# EAGLE design CITestShield (EAGLE 7.3.0)
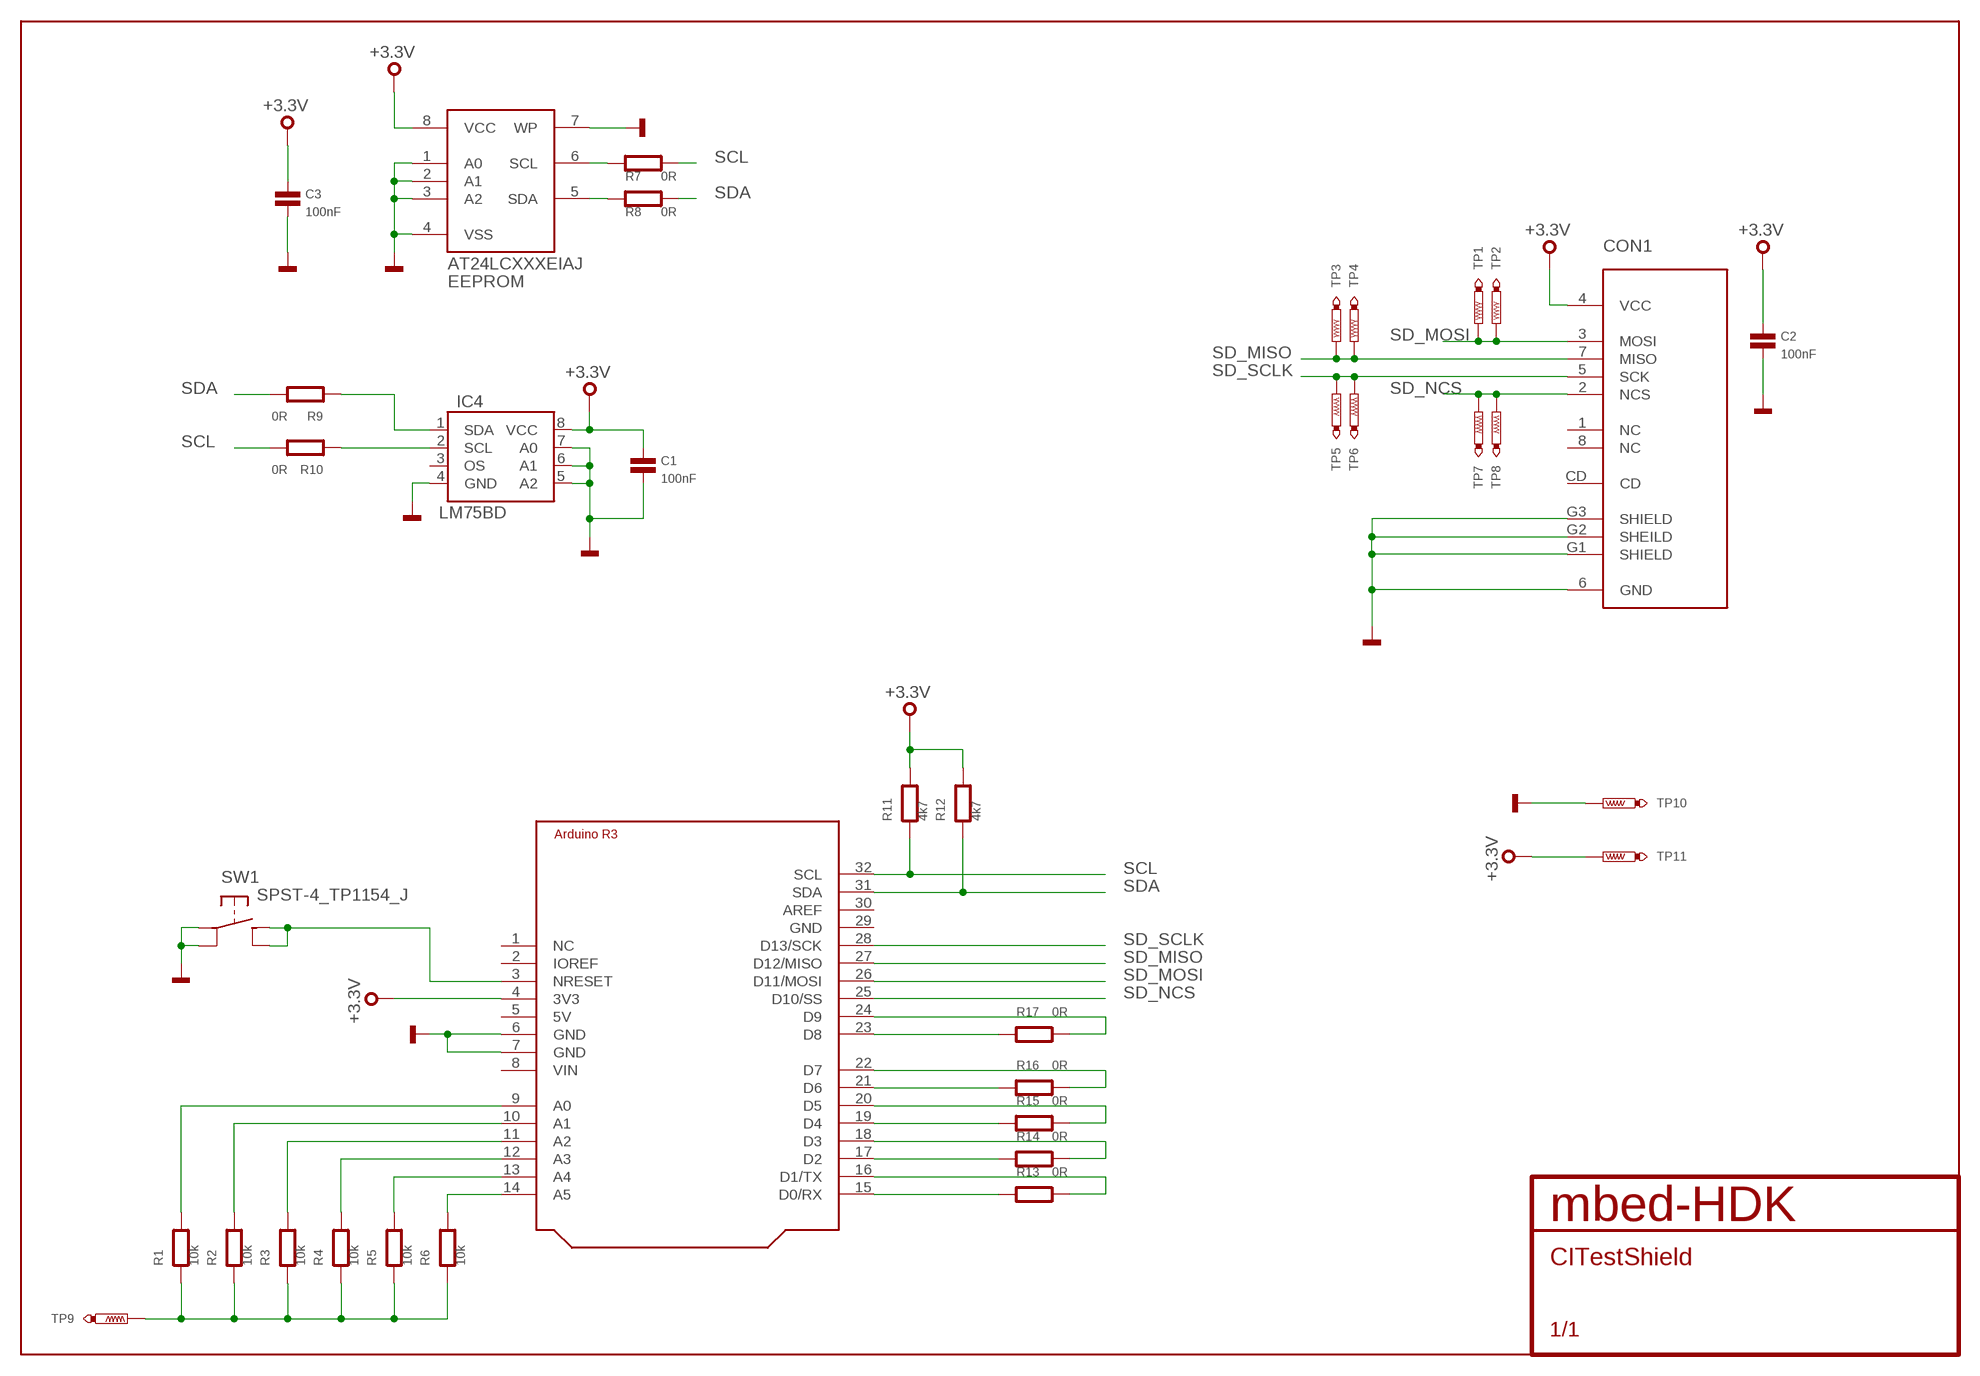
[diagram p0: schematic, sheet 1]

## Parts
BRD1  ARDUINO-R3_SILK  [ARDUINO-R3-SILK]
C1  100nF  C0603  [0603]
C2  100nF  C0603  [0603]
C3  100nF  C0603  [0603]
CON1  MICRO-SD  [AMPHENOL-101-00660-68-6]
EEPROM  AT24LCXXXEIAJ  [SO08-EIAJ]
IC4  LM75BD  [SO8]
R1  10k  R0603  [0603]
R2  10k  R0603  [0603]
R3  10k  R0603  [0603]
R4  10k  R0603  [0603]
R5  10k  R0603  [0603]
R6  10k  R0603  [0603]
R7  0R  R0603  [0603]
R8  0R  R0603  [0603]
R9  0R  R0603  [0603]
R10  0R  R0603  [0603]
R11  4k7  R0603  [0603]
R12  4k7  R0603  [0603]
R13  0R  R0603  [0603]
R14  0R  R0603  [0603]
R15  0R  R0603  [0603]
R16  0R  R0603  [0603]
R17  0R  R0603  [0603]
SW1  SPST-4_TP1154_J  [TP-1154X]
TP1  TEST-POINT-50R-SMD  [TP50-SMD]
TP2  TEST-POINT-50R-SMD  [TP50-SMD]
TP3  TEST-POINT-50R-SMD  [TP50-SMD]
TP4  TEST-POINT-50R-SMD  [TP50-SMD]
TP5  TEST-POINT-50R-SMD  [TP50-SMD]
TP6  TEST-POINT-50R-SMD  [TP50-SMD]
TP7  TEST-POINT-50R-SMD  [TP50-SMD]
TP8  TEST-POINT-50R-SMD  [TP50-SMD]
TP9  TEST-POINT-50R-SMD  [TP50-SMD]
TP10  TEST-POINT-50R-SMD  [TP50-SMD]
TP11  TEST-POINT-50R-SMD  [TP50-SMD]

## Nets
+3.3V: BRD1.4(3V3) C1.1 C2.1 C3.1 CON1.4(VCC) EEPROM.8(VCC) IC4.8(VCC) R11.2 R12.2 TP11.TP
GND: BRD1.6(GND) BRD1.7(GND) C1.2 C2.2 C3.2 CON1.6(GND) CON1.G1(SHIELD) CON1.G2(SHEILD) CON1.G3(SHIELD) EEPROM.1(A0) EEPROM.2(A1) EEPROM.3(A2) EEPROM.4(VSS) EEPROM.7(WP) IC4.4(GND) IC4.5(A2) IC4.6(A1) IC4.7(A0) SW1.A1 SW1.A2 TP10.TP
N$1: R1.1 R2.1 R3.1 R4.1 R5.1 R6.1 TP9.TP
N$2: BRD1.9(A0) R1.2
N$3: BRD1.10(A1) R2.2
N$4: BRD1.11(A2) R3.2
N$5: BRD1.12(A3) R4.2
N$6: BRD1.13(A4) R5.2
N$7: BRD1.14(A5) R6.2
N$8: BRD1.21(D6) R16.1
N$9: BRD1.22(D7) R16.2
N$10: BRD1.24(D9) R17.2
N$11: BRD1.23(D8) R17.1
N$12: BRD1.16(D1/TX) R13.2
N$13: BRD1.15(D0/RX) R13.1
N$14: BRD1.17(D2) R14.1
N$15: BRD1.18(D3) R14.2
N$16: BRD1.20(D5) R15.2
N$17: BRD1.19(D4) R15.1
N$18: BRD1.3(NRESET) SW1.B1 SW1.B2
N$19: IC4.2(SCL) R10.1
N$20: IC4.1(SDA) R9.1
N$22: EEPROM.6(SCL) R7.1
N$23: EEPROM.5(SDA) R8.1
SCL: BRD1.32(SCL) R7.2 R10.2 R11.1
SD_MISO: BRD1.27(D12/MISO) CON1.7(MISO) TP3.TP TP4.TP
SD_MOSI: BRD1.26(D11/MOSI) CON1.3(MOSI) TP1.TP TP2.TP
SD_NCS: BRD1.25(D10/SS) CON1.2(NCS) TP7.TP TP8.TP
SD_SCLK: BRD1.28(D13/SCK) CON1.5(SCK) TP5.TP TP6.TP
SDA: BRD1.31(SDA) R8.2 R9.2 R12.1
Unconnected: BRD1.1(NC) BRD1.2(IOREF) BRD1.5(5V) BRD1.8(VIN) BRD1.29(GND) BRD1.30(AREF) CON1.1(NC) CON1.8(NC) CON1.CD IC4.3(OS)

## Library data of the parts
BRD1 = mbed-HDK:ARDUINO-R3
C1-C3 = mbed-HDK:C: Capacitor
CON1 = mbed-HDK:MICRO-SD
EEPROM = mbed-HDK:AT24LCXXX: I2C EEPROM, 24LC family
IC4 = mbed-HDK:LM75BD
R1-R17 = mbed-HDK:R
SW1 = mbed-HDK:SPST-4
TP1-TP11 = mbed-HDK:TEST-POINT

## Board
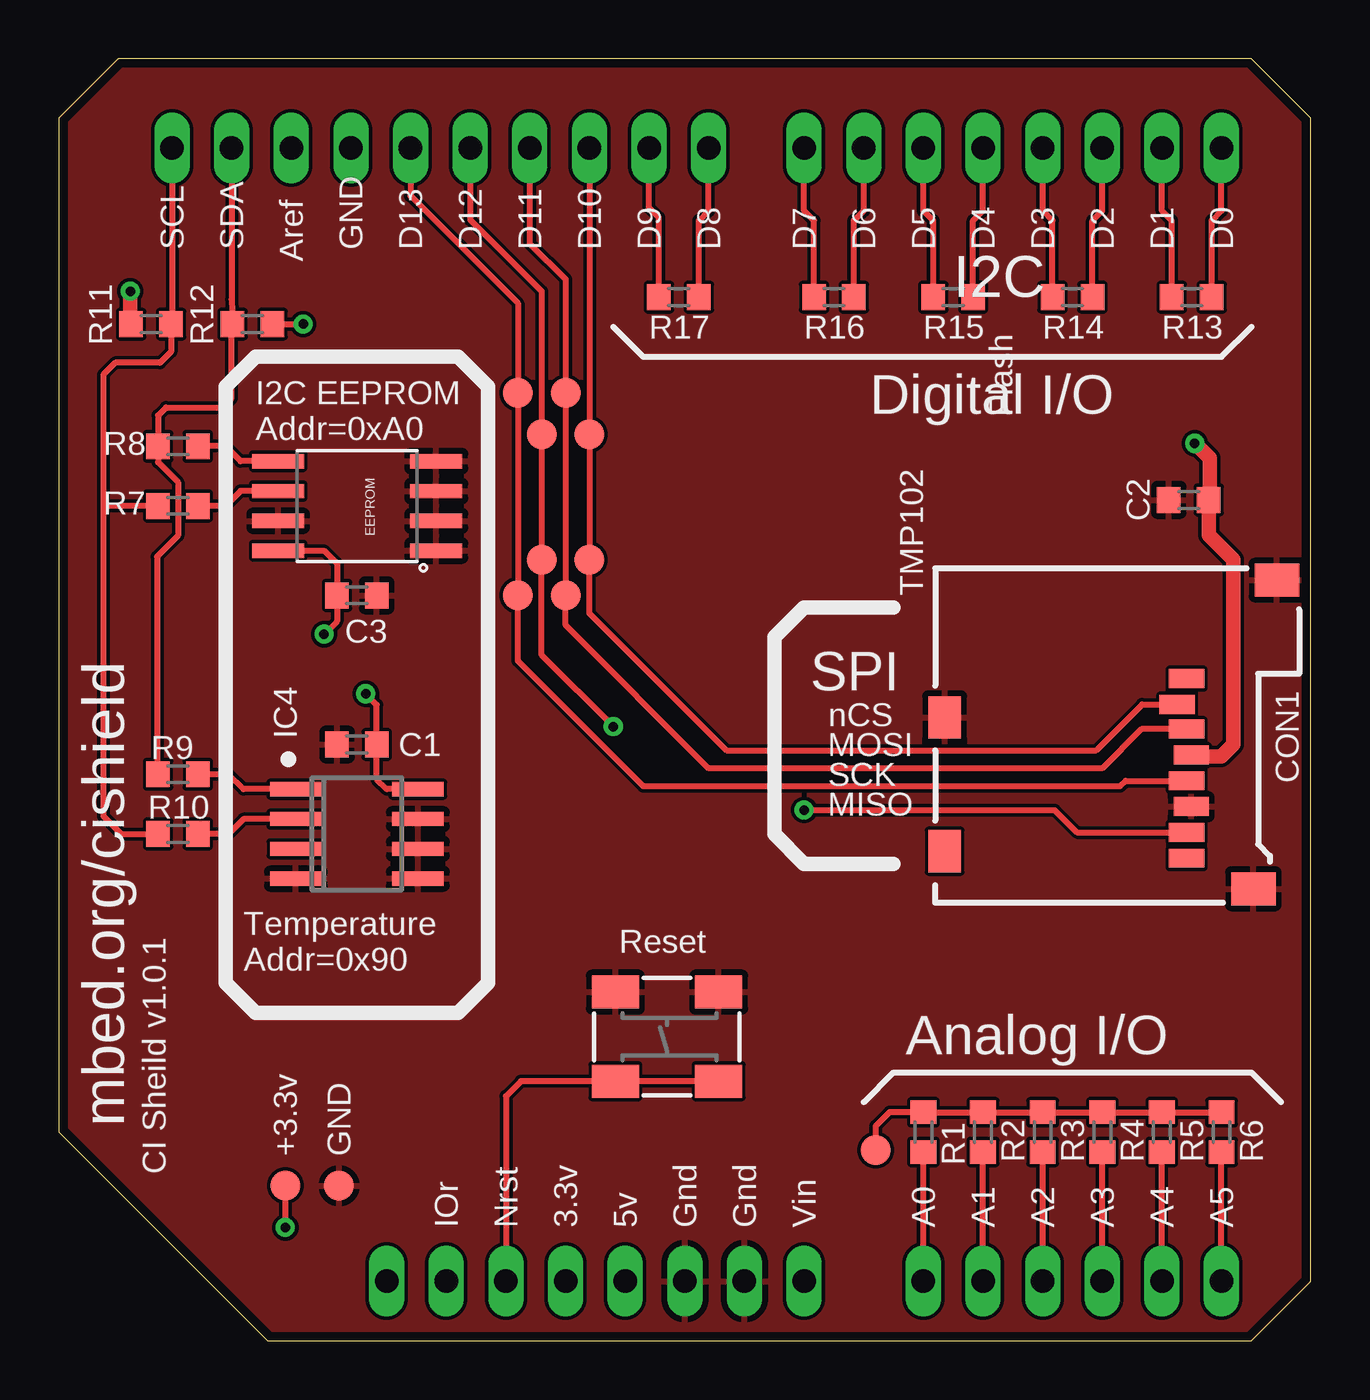
[diagram p1: board, top side]
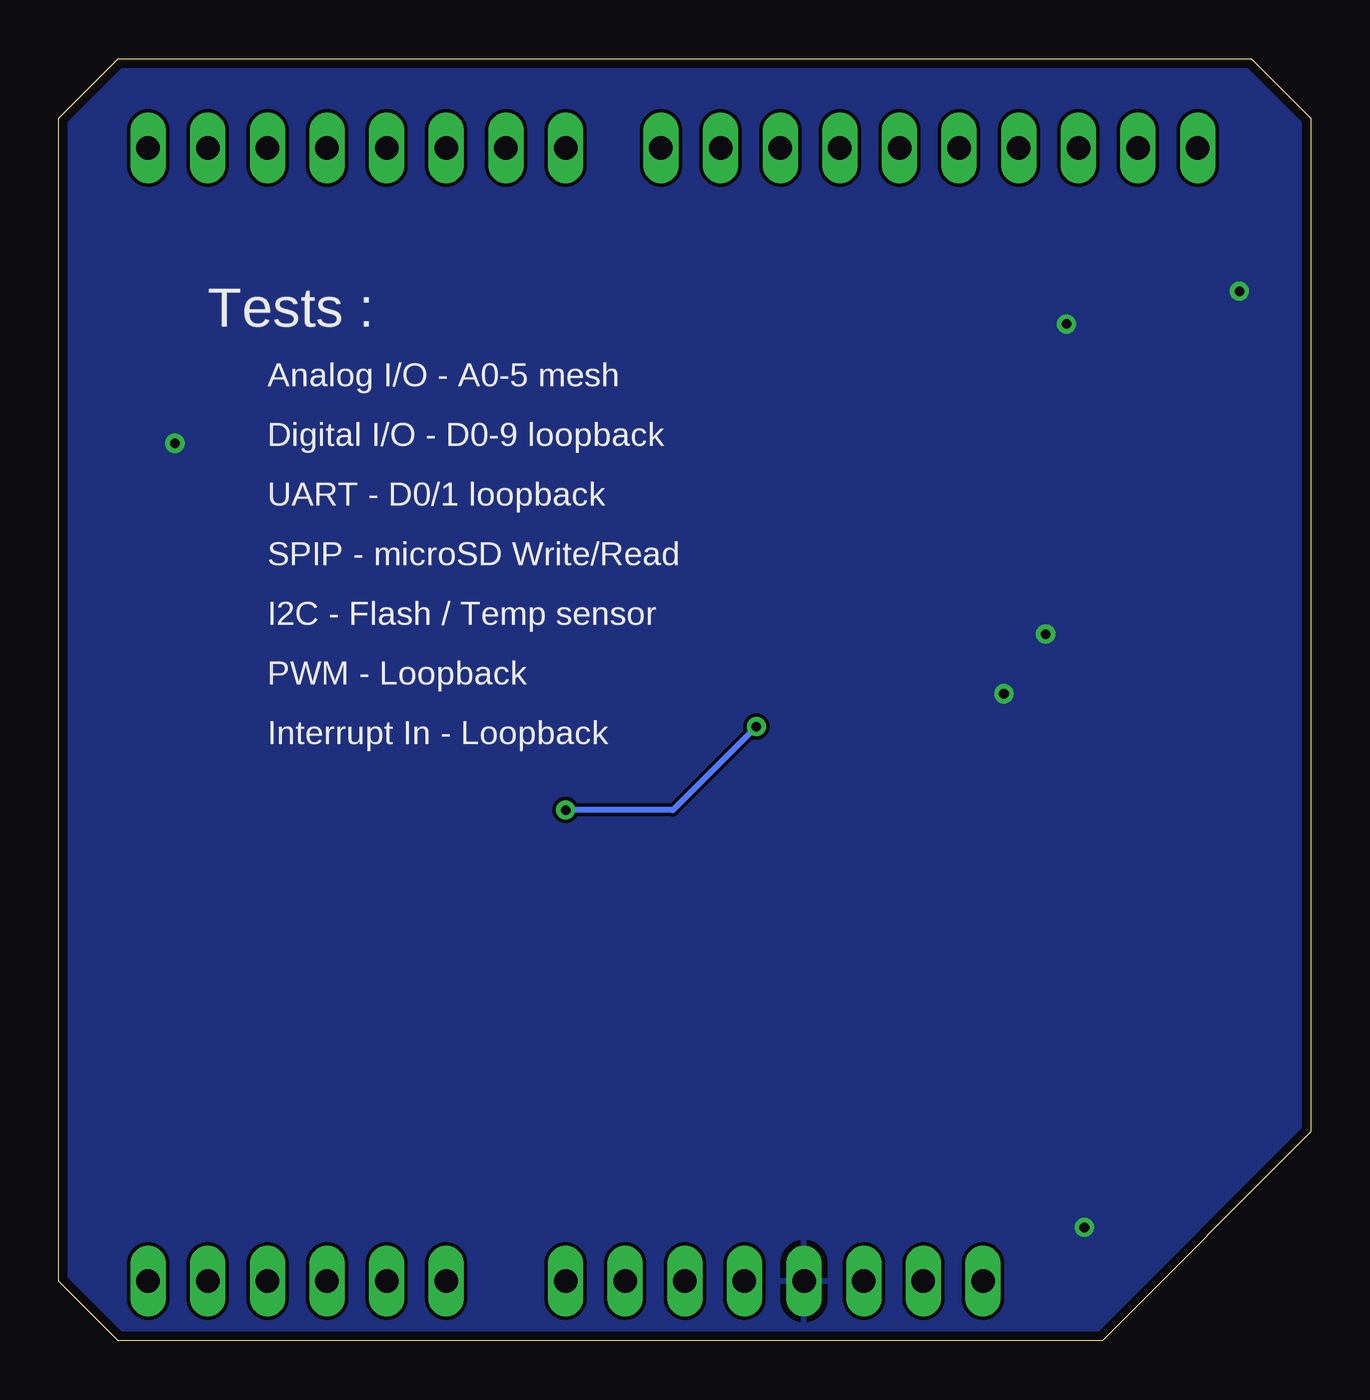
[diagram p2: board, bottom side, seen from below]

Size 53.34 x 54.61 mm. Coordinates in mm from the lower left corner, seen from the top.
Outline: 0,8.89 8.89,0 50.8,0 53.34,2.54 53.34,52.07 50.8,54.61 2.54,54.61 0,52.07 0,8.89
Copper layers ((1*16)): Top 0.035mm / dielectric 0.8mm / Bottom 0.035mm
Design rules "mbed-HDK-6-6-2-layer": minimum track width 6mil, minimum drill 9mil, track to track 6mil, track to pad 6mil, pad to pad 6mil, via to via 6mil, smd to smd 6mil, copper to edge 15mil, drill to drill 8mil, minimum pad ring 10mil, minimum via ring 8mil, stop-mask expansion 4mil, vias tented up to drill 0mil, thermal gap 10mil

### Footprints (pad centres in the part's own frame; a part is rotated, then mirrored left to right if it is on the bottom)
ARDUINO-R3-SILK = drill 1 long: 1 27.94,2.54; 2 30.48,2.54; 3 33.02,2.54; 4 35.56,2.54; 5 38.1,2.54; 6 40.64,2.54; 7 43.18,2.54; 8 45.72,2.54; 9 50.8,2.54; 10 53.34,2.54; 11 55.88,2.54; 12 58.42,2.54; 13 60.96,2.54; 14 63.5,2.54; 15 63.5,50.8; 16 60.96,50.8; 17 58.42,50.8; 18 55.88,50.8; 19 53.34,50.8; 20 50.8,50.8; 21 48.26,50.8; 22 45.72,50.8; 23 41.656,50.8; 24 39.116,50.8; 25 36.576,50.8; 26 34.036,50.8; 27 31.496,50.8; 28 28.956,50.8; 29 26.416,50.8; 30 23.876,50.8; 31 21.336,50.8; 32 18.796,50.8
0603 = smd 1 x 1.1: 1 -0.85,0; 2 0.85,0
AMPHENOL-101-00660-68-6 = smd 0.8 x 1.5: 1 -2.55,10.7; 2 -1.45,10.3; 3 -0.4,10.7; 4 0.7,10.9; 5 1.8,10.7; 6 2.9,10.9; 7 4,10.7; 8 5.1,10.7 | smd 1.8 x 1.4: CD 4.8,0.4; G1 -0.9,0.4 | smd 1.4 x 1.9: G2 6.4,13.55; G3 -6.75,14.55
SO08-EIAJ = smd 0.61 x 2.21: 1 -1.905,-3.378; 2 -0.635,-3.378; 3 0.635,-3.378; 4 1.905,-3.378; 5 1.905,3.353; 6 0.635,3.353; 7 -0.635,3.353; 8 -1.905,3.353
SO8 = smd 0.6 x 2.2: 1 -1.905,-2.6; 2 -0.635,-2.6; 3 0.635,-2.6; 4 1.905,-2.6; 5 1.905,2.6; 6 0.635,2.6; 7 -0.635,2.6; 8 -1.905,2.6
TP-1154X = smd 2 x 1.4: A1 -2.2,1.9; A2 2.2,1.9; B1 -2.2,-1.9; B2 2.2,-1.9
TP50-SMD = smd 1.27 x 1.27: TP 0,0

### Placement (x,y rotation side)
BRD1  -13.97,0 0 top
C1  12.7,25.4 180 top
C2  48.13,35.81 180 top
C3  12.7,31.75 0 top
CON1  37.34,25.65 270 top
EEPROM  12.7,35.56 90 top
IC4  12.7,21.59 270 top
R1  36.83,8.89 270 top
R2  39.37,8.89 270 top
R3  41.91,8.89 270 top
R4  44.45,8.89 270 top
R5  46.99,8.89 270 top
R6  49.53,8.89 270 top
R7  5.08,35.56 180 top
R8  5.08,38.1 180 top
R9  5.08,24.13 180 top
R10  5.08,21.59 180 top
R11  3.94,43.31 180 top
R12  8.26,43.31 0 top
R13  48.26,44.45 180 top
R14  43.18,44.45 180 top
R15  38.1,44.45 180 top
R16  33.02,44.45 180 top
R17  26.42,44.45 180 top
SW1  25.91,12.95 0 top
TP1  21.59,40.39 0 top
TP2  21.59,31.75 0 top
TP3  20.57,38.61 0 top
TP4  20.57,33.27 0 top
TP5  19.56,40.39 0 top
TP6  19.56,31.75 0 top
TP7  22.61,38.61 0 top
TP8  22.61,33.27 0 top
TP9  34.8,8.13 0 top
TP10  11.94,6.6 0 top
TP11  9.65,6.6 0 top

### Tracks (layer width: path | path; a pad name or v marks a point on that pad's centre or on a via)
+3.3V  (via drill 0.41)
  Top 0.254: R12.2 v10.41,43.31 | IC4.8 13.97,23.5 13.55,23.91 C1.1 13.55,27.09 v13.08,27.56 | EEPROM.8 11.3,33.66 11.85,33.11 C3.1 11.85,30.65 v11.3,30.1 | TP11.TP v9.65,4.83
  Top 0.61: v3.05,44.7 3.05,43.35 R11.2 | v48.39,38.23 49.02,37.59 49.02,35.85 C2.1 48.98,34.33 50.04,33.27 50.04,25.4 49.53,24.89 48.3,24.89 CON1.4
  pour Bottom: 0,52.07 0,8.89 8.89,0 50.8,0 53.34,2.54 53.34,52.07 50.8,54.61 2.54,54.61
GND
  pour Top: 8.89,0 50.8,0 53.34,2.54 53.34,52.07 50.8,54.61 2.54,54.61 0,52.07 0,8.89
N$1
  Top 0.254: R6.1 R5.1 R4.1 R3.1 R2.1 R1.1 35.39,9.74 34.8,9.14 TP9.TP
N$2
  Top 0.254: BRD1.9 R1.2
N$3
  Top 0.254: BRD1.10 R2.2
N$4
  Top 0.254: BRD1.11 R3.2
N$5
  Top 0.254: BRD1.12 R4.2
N$6
  Top 0.254: BRD1.13 R5.2
N$7
  Top 0.254: BRD1.14 R6.2
N$8
  Top 0.254: R16.1 33.87,47.71 34.29,48.13 BRD1.21
N$9
  Top 0.254: R16.2 32.17,47.71 31.75,48.13 BRD1.22
N$10
  Top 0.254: R17.2 25.57,47.84 25.15,48.26 BRD1.24
N$11
  Top 0.254: R17.1 27.27,47.71 27.69,48.13 BRD1.23
N$12
  Top 0.254: R13.2 47.41,47.71 46.99,48.13 BRD1.16
N$13
  Top 0.254: R13.1 49.11,47.71 49.53,48.13 BRD1.15
N$14
  Top 0.254: R14.1 44.03,47.71 44.45,48.13 BRD1.17
N$15
  Top 0.254: R14.2 42.33,47.71 41.91,48.13 BRD1.18
N$16
  Top 0.254: R15.2 37.25,47.71 36.83,48.13 BRD1.20
N$17
  Top 0.254: R15.1 38.95,47.71 39.37,48.13 BRD1.19
N$18
  Top 0.254: SW1.B2 SW1.B1 19.69,11.05 19.05,10.41 BRD1.3
  Top 0.61: 18.93,2.66 BRD1.3
N$19
  Top 0.254: IC4.2 7.87,22.23 7.24,21.59 R10.1
N$20
  Top 0.254: IC4.1 7.87,23.5 7.24,24.13 R9.1
N$22
  Top 0.254: EEPROM.6 7.75,36.2 7.11,35.56 R7.1
N$23
  Top 0.254: EEPROM.5 7.75,37.47 7.11,38.1 R8.1
SCL
  Top 0.254: BRD1.32 4.83,43.6 R11.1 4.79,42.12 4.32,41.66 2.41,41.66 1.9,41.15 1.9,35.69 | 1.9,35.69 1.9,22.35 2.67,21.59 R10.2 | R7.2 2.03,35.56 1.9,35.69
SD_MISO  (via drill 0.41)
  Top 0.254: BRD1.27 17.53,47.75 20.57,44.7 TP3.TP TP4.TP 20.57,29.21 v23.62,26.16 | v31.75,22.61 42.42,22.61 43.37,21.65 CON1.7
  Bottom 0.254: v23.62,26.16 27.18,22.61 v31.75,22.61
SD_MOSI
  Top 0.254: BRD1.26 20.07,46.74 21.59,45.21 TP1.TP TP2.TP 21.59,30.48 27.69,24.38 44.45,24.38 46.12,26.05 CON1.3
SD_NCS
  Top 0.254: CON1.2 46.15,27.1 44.2,25.15 28.45,25.15 22.61,30.99 TP8.TP TP7.TP BRD1.25
SD_SCLK
  Top 0.254: BRD1.28 14.99,48.77 19.56,44.2 TP5.TP TP6.TP 19.56,28.96 24.89,23.62 45.21,23.62 45.44,23.85 CON1.5 48.02,23.88
SDA
  Top 0.254: BRD1.31 7.37,44.36 R12.1 7.37,43.27 7.37,40.13 6.98,39.75 4.57,39.75 4.23,39.41 R8.2 4.23,37.43 5.08,36.58 5.08,34.29 4.19,33.4 4.19,24.17 R9.2

### Text on the board
tPlace: SCL | SDA | Aref | GND | D13 | D12 | D11 | D10 | D9 | D8 | D7 | D6 | D5 | D4 | D3 | D2 | D1 | D0 | Digital I/O | I2C EEPROM | Addr=0xA0 | SPI | nCS | MOSI | SCK | MISO | Temperature | Reset | Addr=0x90 | Analog I/O | mbed.org/cishield | +3.3v | GND | CI Sheild v1.0.1 | IOr | Nrst | 3.3v | 5v | Gnd | Gnd | Vin | A0 | A1 | A2 | A3 | A4 | A5
bPlace: Tests : | Analog I/O - A0-5 mesh | Digital I/O - D0-9 loopback | UART - D0/1 loopback | SPIP - microSD Write/Read | I2C - Flash / Temp sensor | PWM - Loopback | Interrupt In - Loopback
_tsilk: I2C | Flash | TMP102